# EAGLE schematic Enclosure 100x68 PBC (EAGLE 9.6.2)
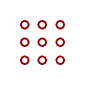
[diagram p0: schematic, sheet 1]

## Parts
U$1  PROTO-34X22-C  [PROTO-34X22-C]

## Library data of the parts
U$1 = digitalconcepts:PROTO-34X22-C: 34 x 22 Prototyping board, with cut-outs, to fit an 100 x 68 enclosure